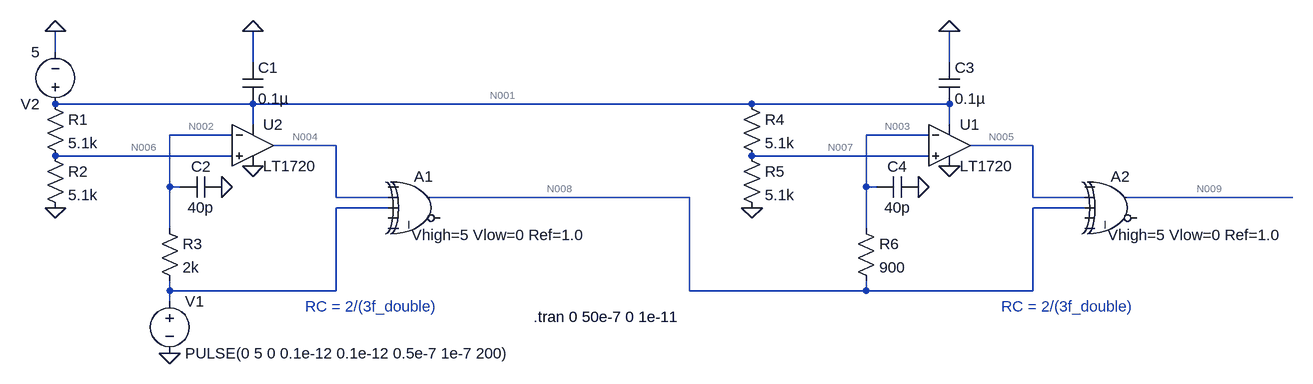
[diagram p0: schematic Draft1.asc]
Draft1.asc, the LTspice schematic file:
Version 4
SHEET 1 2316 680
WIRE 256 16 256 -16
WIRE 560 32 560 -16
WIRE 1632 32 1632 -16
WIRE 560 96 256 96
WIRE 1328 96 560 96
WIRE 1632 96 1328 96
WIRE 560 128 560 96
WIRE 1632 128 1632 96
WIRE 528 144 432 144
WIRE 1600 144 1504 144
WIRE 688 160 592 160
WIRE 1760 160 1664 160
WIRE 528 176 256 176
WIRE 1600 176 1328 176
WIRE 432 224 432 144
WIRE 448 224 432 224
WIRE 1504 224 1504 144
WIRE 1520 224 1504 224
WIRE 688 240 688 160
WIRE 768 240 688 240
WIRE 1232 240 832 240
WIRE 1760 240 1760 160
WIRE 1840 240 1760 240
WIRE 2160 240 1904 240
WIRE 768 256 688 256
WIRE 1840 256 1760 256
WIRE 432 288 432 224
WIRE 1504 288 1504 224
WIRE 432 384 432 368
WIRE 688 384 688 256
WIRE 688 384 432 384
WIRE 1232 384 1232 240
WIRE 1504 384 1504 368
WIRE 1504 384 1232 384
WIRE 1760 384 1760 256
WIRE 1760 384 1504 384
WIRE 432 400 432 384
FLAG 432 480 0
FLAG 256 256 0
FLAG 560 192 0
FLAG 256 -16 0
FLAG 560 -16 0
FLAG 512 224 0
FLAG 1328 256 0
FLAG 1632 192 0
FLAG 1632 -16 0
FLAG 1584 224 0
SYMBOL voltage 432 384 R0
WINDOW 123 0 0 Left 0
WINDOW 39 0 0 Left 0
SYMATTR InstName V1
SYMATTR Value PULSE(0 5 0 0.1e-12 0.1e-12 0.5e-7 1e-7 200)
SYMBOL Digital\\xor 816 192 R0
WINDOW 39 -12 106 Left 2
SYMATTR SpiceLine Vhigh=5 Vlow=0 Ref=1.0
SYMATTR InstName A1
SYMBOL cap 544 32 R0
SYMATTR InstName C1
SYMATTR Value 0.1µ
SYMBOL voltage 256 112 R180
WINDOW 123 0 0 Left 0
WINDOW 39 0 0 Left 0
SYMATTR InstName V2
SYMATTR Value 5
SYMBOL res 240 80 R0
SYMATTR InstName R1
SYMATTR Value 5.1k
SYMBOL res 240 160 R0
SYMATTR InstName R2
SYMATTR Value 5.1k
SYMBOL res 416 272 R0
SYMATTR InstName R3
SYMATTR Value 2k
SYMBOL cap 512 208 R90
WINDOW 0 0 32 VBottom 2
WINDOW 3 32 32 VTop 2
SYMATTR InstName C2
SYMATTR Value 40p
SYMBOL Comparators\\LT1720 560 96 R0
SYMATTR InstName U2
SYMBOL Digital\\xor 1888 192 R0
WINDOW 39 -12 106 Left 2
SYMATTR SpiceLine Vhigh=5 Vlow=0 Ref=1.0
SYMATTR InstName A2
SYMBOL cap 1616 32 R0
SYMATTR InstName C3
SYMATTR Value 0.1µ
SYMBOL res 1312 80 R0
SYMATTR InstName R4
SYMATTR Value 5.1k
SYMBOL res 1312 160 R0
SYMATTR InstName R5
SYMATTR Value 5.1k
SYMBOL res 1488 272 R0
SYMATTR InstName R6
SYMATTR Value 900
SYMBOL cap 1584 208 R90
WINDOW 0 0 32 VBottom 2
WINDOW 3 32 32 VTop 2
SYMATTR InstName C4
SYMATTR Value 40p
SYMBOL Comparators\\LT1720 1632 96 R0
SYMATTR InstName U1
TEXT 640 408 Left 2 ;RC = 2/(3f_double)
TEXT 992 424 Left 2 !.tran 0 50e-7 0 1e-11
TEXT 1712 408 Left 2 ;RC = 2/(3f_double)

The netlist it stands for:
* Draft1.asc
V1 N010 0 PULSE(0 5 0 0.1e-12 0.1e-12 0.5e-7 1e-7 200)
A1 0 N004 N010 0 0 0 N008 0 XOR Vhigh=5 Vlow=0 Ref=1.0
C1 0 N001 0.1µ
V2 N001 0 5
R1 N001 N006 5.1k
R2 N006 0 5.1k
R3 N002 N010 2k
C2 0 N002 40p
XU2 N006 N002 N001 0 N004 LT1720  ; pins In+ In- V+ V- OUT
A2 0 N005 N008 0 0 0 N009 0 XOR Vhigh=5 Vlow=0 Ref=1.0
C3 0 N001 0.1µ
R4 N001 N007 5.1k
R5 N007 0 5.1k
R6 N003 N008 900
C4 0 N003 40p
XU1 N007 N003 N001 0 N005 LT1720  ; pins In+ In- V+ V- OUT
* RC = 2/(3f_double)
.tran 0 50e-7 0 1e-11
* RC = 2/(3f_double)
.lib LT1720.sub
.backanno
.end

* Results of the author's LTspice run, read from the files saved beside the schematic
* Operating Point, zero values left out:
*   V(n004) = 4.819 V
*   V(n008) = 5 V
*   V(n001) = 5 V
*   V(n006) = 2.5 V
*   V(n002) = 10 mV
*   V(n005) = 171.5 mV
*   V(n009) = 5 V
*   V(n007) = 2.513 V
*   V(n003) = 4.998 V
*   I(R1) = 490.2 µA
*   I(R2) = 490.2 µA
*   I(R3) = 5 µA
*   I(R4) = 487.7 µA
*   I(R5) = 492.7 µA
*   I(R6) = -2.5 µA
*   I(V1) = 5 µA
*   I(V2) = -8.977 mA
*   I8(A1) = 2.5 µA
*   I7(A1) = -2.5 µA
*   Ix(u2:1) = -100 pA
*   Ix(u2:2) = -5 µA
*   Ix(u2:3) = 4.001 mA
*   Ix(u2:4) = -3.996 mA
*   Ix(u2:5) = -4.648 pA
*   Ix(u1:1) = -5 µA
*   Ix(u1:2) = 2.5 µA
*   Ix(u1:3) = 3.998 mA
*   Ix(u1:4) = -3.995 mA
*   Ix(u1:5) = 4.647 pA